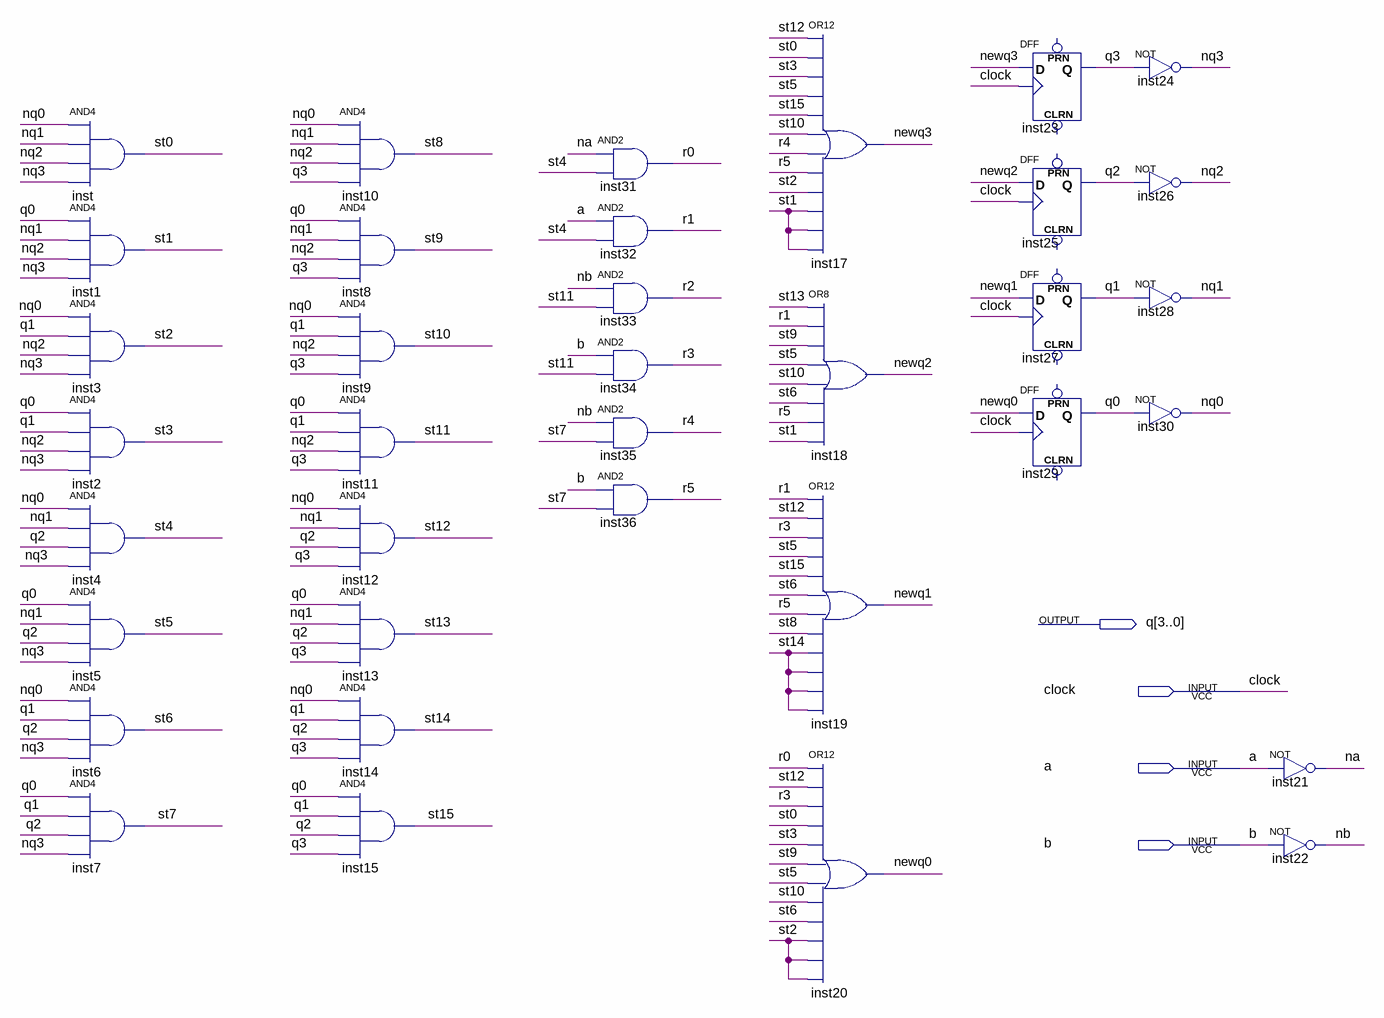
[diagram p0: schematic sheet]
// Quartus schematic Prac6.bdf as structural Verilog: 36 symbols, 4 pins
module Prac6 (
  input  clock,
  input  a,
  input  b,
  output [3:0] q
);

  wire na, nb, newq0, newq1, newq2, newq3, nq0, nq1, nq2, nq3, r0, r1, r2, r3, r4, r5, st0, st1, st2, st3,
       st4, st5, st6, st7, st8, st9, st10, st11, st12, st13, st14, st15;

  and inst (st0, nq0, nq1, nq2, nq3);
  and inst1 (st1, q[0], nq1, nq2, nq3);
  and inst3 (st2, nq0, q[1], nq2, nq3);
  and inst2 (st3, q[0], q[1], nq2, nq3);
  and inst4 (st4, nq0, nq1, q[2], nq3);
  and inst5 (st5, q[0], nq1, q[2], nq3);
  and inst6 (st6, nq0, q[1], q[2], nq3);
  and inst7 (st7, q[0], q[1], q[2], nq3);
  and inst10 (st8, nq0, nq1, nq2, q[3]);
  and inst8 (st9, q[0], nq1, nq2, q[3]);
  and inst9 (st10, nq0, q[1], nq2, q[3]);
  and inst11 (st11, q[0], q[1], nq2, q[3]);
  and inst12 (st12, nq0, nq1, q[2], q[3]);
  and inst13 (st13, q[0], nq1, q[2], q[3]);
  and inst14 (st14, nq0, q[1], q[2], q[3]);
  and inst15 (st15, q[0], q[1], q[2], q[3]);
  and inst31 (r0, na, st4);
  and inst32 (r1, a, st4);
  and inst33 (r2, nb, st11);
  and inst34 (r3, b, st11);
  and inst35 (r4, nb, st7);
  and inst36 (r5, b, st7);
  or inst17 (newq3, st12, st0, st3, st5, st15, st10, r4, r5, st2, st1, st1, st1);
  or inst18 (newq2, st13, r1, st9, st5, st10, st6, r5, st1);
  or inst19 (newq1, r1, st12, r3, st5, st15, st6, r5, st8, st14, st14, st14, st14);
  or inst20 (newq0, r0, st12, r3, st0, st3, st9, st5, st10, st6, st2, st2, st2);
  DFF inst23 (.CLK(clock), .D(newq3), .Q(q[3]));  // open: CLRN, PRN
  DFF inst25 (.CLK(clock), .D(newq2), .Q(q[2]));  // open: CLRN, PRN
  DFF inst27 (.CLK(clock), .D(newq1), .Q(q[1]));  // open: CLRN, PRN
  DFF inst29 (.CLK(clock), .D(newq0), .Q(q[0]));  // open: CLRN, PRN
  not inst24 (nq3, q[3]);
  not inst26 (nq2, q[2]);
  not inst28 (nq1, q[1]);
  not inst30 (nq0, q[0]);
  not inst21 (na, a);
  not inst22 (nb, b);
endmodule
